# Altium schematic sheet 595andMun.SchDoc
size Letter; Organization: Altium Limited; Address1: L3, 12a Rodborough Rd; Address2: Frenchs Forest; Address3: NSW; Address4: Australia 2086
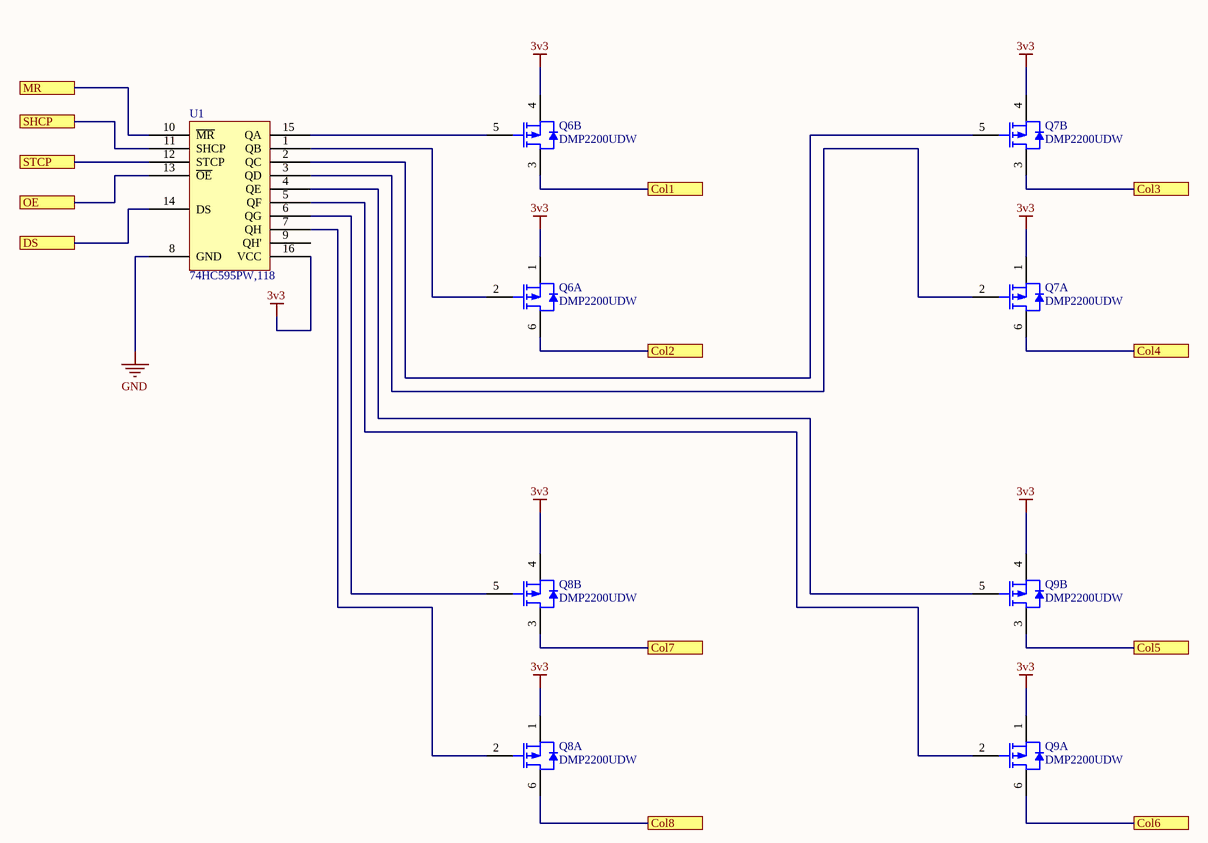
[diagram p0: 595andMun.SchDoc]

## Parts
Q6  DMP2200UDW  [DIOD-SOT363-6_V]  (parts A,B of 2)
Q7  DMP2200UDW  [DIOD-SOT363-6_V]  (parts A,B of 2)
Q8  DMP2200UDW  [DIOD-SOT363-6_V]  (parts A,B of 2)
Q9  DMP2200UDW  [DIOD-SOT363-6_V]  (parts A,B of 2)
U1  74HC595PW,118  [TSOP65P640X110-16N]

## Ports
Col1, Col2, Col3, Col4, Col5, Col6, Col7, Col8, DS, MR, OE, SHCP, STCP

## Nets
3v3: Q6.1(S) Q6.4(S) Q7.1(S) Q7.4(S) Q8.1(S) Q8.4(S) Q9.1(S) Q9.4(S) U1.16(VCC)
GND: U1.8(GND)
Col1: Q6.3(D) ; port Col1
Col2: Q6.6(D) ; port Col2
Col3: Q7.3(D) ; port Col3
Col4: Q7.6(D) ; port Col4
Col5: Q9.3(D) ; port Col5
Col6: Q9.6(D) ; port Col6
Col7: Q8.3(D) ; port Col7
Col8: Q8.6(D) ; port Col8
DS: U1.14(DS) ; port DS
MR: U1.10(~{MR}) ; port MR
OE: U1.13(~{OE}) ; port OE
SHCP: U1.11(SHCP) ; port SHCP
STCP: U1.12(STCP) ; port STCP
NetQ6_2: Q6.2(G) U1.1(QB)
NetQ6_5: Q6.5(G) U1.15(QA)
NetQ7_2: Q7.2(G) U1.3(QD)
NetQ7_5: Q7.5(G) U1.2(QC)
NetQ8_2: Q8.2(G) U1.7(QH)
NetQ8_5: Q8.5(G) U1.6(QG)
NetQ9_2: Q9.2(G) U1.5(QF)
NetQ9_5: Q9.5(G) U1.4(QE)

Not connected (* = marked no-connect by the designer): U1 9(QH')

## Notes on the sheet
- Title
- Size:
- Date:
- Letter
- Number:
- Time:
- Revision:
- Sheet
- of
- Copyright 2019
- Specialized Solutions LLC
- 206 W Lincoln Hwy STE B
- New Haven, IN 46774
- www.specsolns.com <http://www.specsolns.com>
- File:

## Library data of the parts
Q6-Q9 = CMP-2000-05971-1: Dual P-Channel Enhancement Mode MOSFET, 50 VDS, -55 to 150 degC, 6-Pin SOT363, RoHS, Tape and Reel; Manufacturer: DiodesIncorporated; Vgs - Gate-Source Voltage: 20V; Typical Turn-On Delay Time: 10ns; Forward Transconductance - Min: 0.05S; Id - Continuous Drain Current: -130mA; Transistor Type: 2P-Channel; Typical Turn-Off Delay Time: 18ns; Unit Weight: 0.000212oz; Vds - Drain-Source Breakdown Voltage: -50V; Number of Channels: 2Channel; Pd - Power Dissipation: 300mW; Type: EnhancementModeFieldEffectTransistor; Rds On - Drain-Source Resistance: 6Ohms; Package Description: 6-Pin Small Outline Transistor, Body 1.25 x 2 mm, Pitch 0.65 mm; RoHS: True; Manufacturer URL: http://www.diodes.com/; Packaging: Reel; Series: BSS84; Mounting Style: SMD/SMT; Technology: Si; Height: 1mm; Configuration: Dual; Package Reference: SOT363-6; Length: 2.2mm; Mounting Technology: SurfaceMount; Factory Pack Quantity: 3000; Brand: DiodesIncorporated; Maximum Operating Temperature: +150C; Minimum Operating Temperature: -55C; Product Category: MOSFET; Datasheet URL: http://www.diodes.com/_files/datasheets/ds30204.pdf; Width: 1.35mm; Product: MOSFETSmallSignal; Channel Mode: Enhancement; Transistor Polarity: P-Channel; Datasheet Version: Rev. 18-2, 01/2014; Package / Case: SOT-363-6; PartId: 1
U1 = 74HC595PW,118: IC SHIFT REGISTER 8BIT 16TSSOP